# Altium schematic sheet Sensor.SchDoc
size A4; SheetNumber: 5; SheetTotal: 5
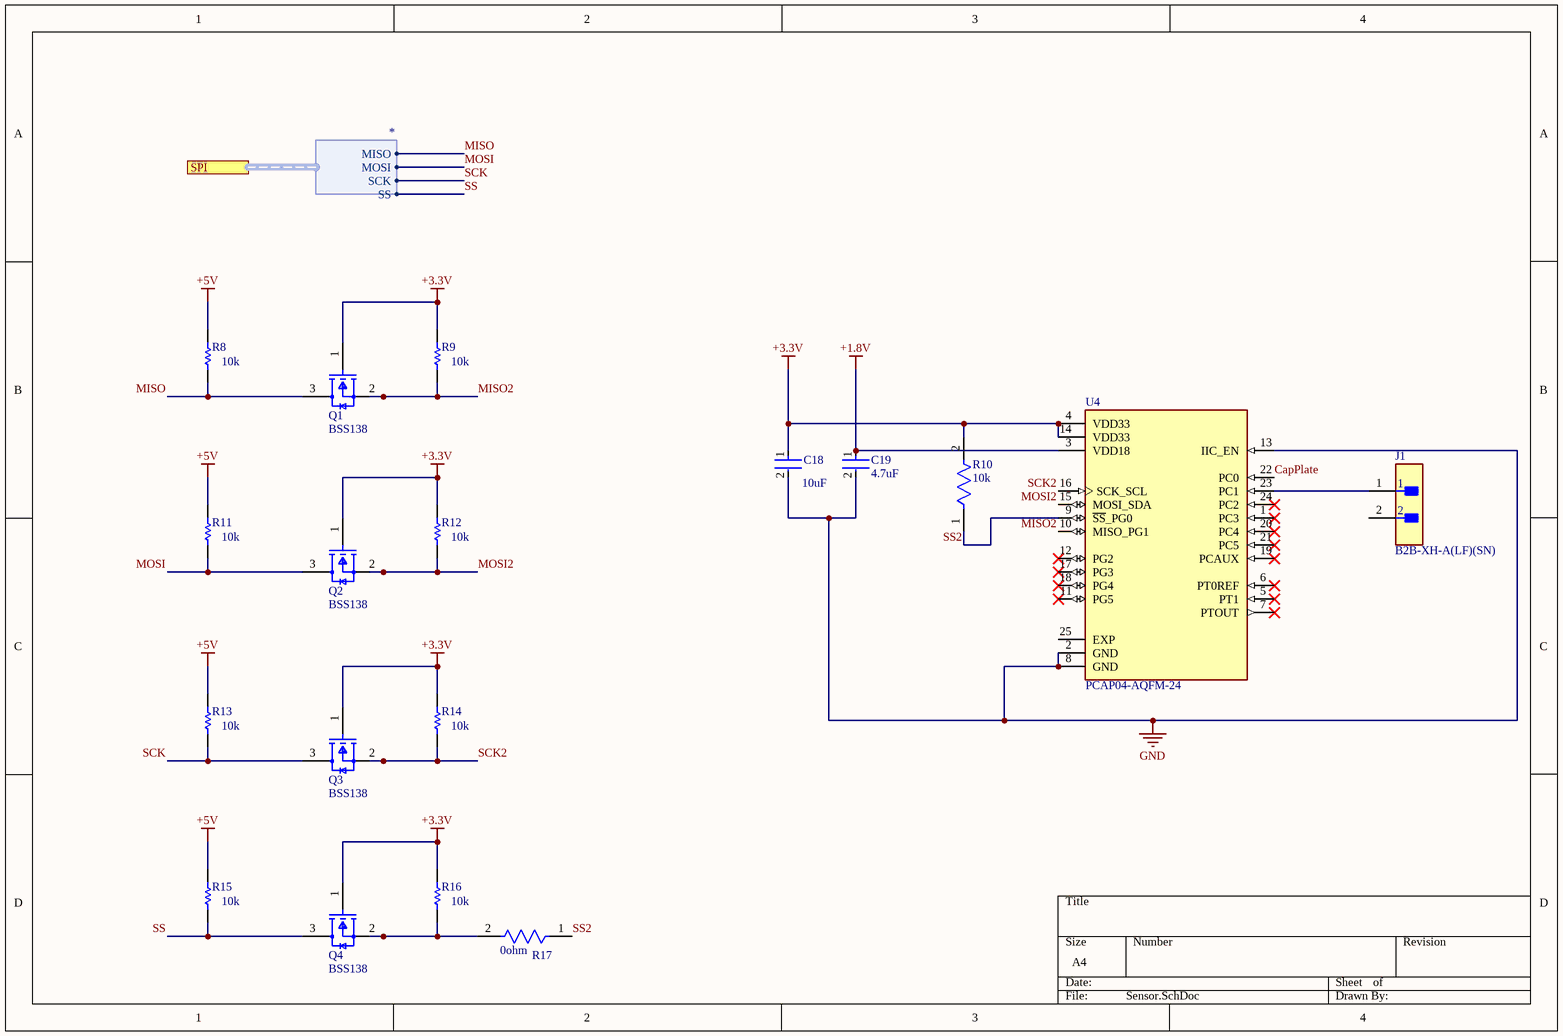
[diagram p0: Sensor.SchDoc]

## Parts
C18  Capacitance: 10uF  [FP-C0805C-DG-MFG]  (hidden comment: C0805C106K8PACTU)
C19  4.7uF  [FP-C0805C475K8PACTU-MFG]
J1  B2B-XH-A(LF)(SN)  [FP-B2B-XH-A_LF_SN-MFG]
Q1  BSS138  [FP-318-08-IPC_B]
Q2  BSS138  [FP-318-08-IPC_B]
Q3  BSS138  [FP-318-08-IPC_B]
Q4  BSS138  [FP-318-08-IPC_B]
R8  10k  [RESC3116X65X50NL20T20]
R9  10k  [RESC3116X65X50NL20T20]
R10  Resistance: 10k  [FP-CRCW0805-e3-IPC_C]  (hidden comment: CRCW080522R0FKEA)
R11  10k  [RESC3116X65X50NL20T20]
R12  10k  [RESC3116X65X50NL20T20]
R13  10k  [RESC3116X65X50NL20T20]
R14  10k  [RESC3116X65X50NL20T20]
R15  10k  [RESC3116X65X50NL20T20]
R16  10k  [RESC3116X65X50NL20T20]
R17  Resistance: 0ohm  [FP-CRCW0805-e3-IPC_C]  (hidden comment: CRCW080522R0FKEA)
U4  PCAP04-AQFM-24  [IC_PCAP04-AQFM-24]

## Ports
SPI (harness *, see Sheet2[2B], MCU[4C])

## Harnesses
*: MISO, MOSI, SCK, SS

## Nets
+1.8V: C19.1 U4.3(VDD18)
+3.3V: C18.1 Q1.1(G) Q2.1(G) Q3.1(G) Q4.1(G) R9.2 R10.2 R12.2 R14.2 R16.2 U4.4(VDD33) U4.14(VDD33)
+5V: R8.2 R11.2 R13.2 R15.2
GND: C18.2 C19.2 U4.2(GND) U4.8(GND) U4.13(IIC_EN)
CapPlate: U4.22(PC0)
MISO: Q1.3(D) R8.1 ; port SPI.MISO
MISO2: Q1.2(S) R9.1 U4.10(MISO_PG1)
MOSI: Q2.3(D) R11.1 ; port SPI.MOSI
MOSI2: Q2.2(S) R12.1 U4.15(MOSI_SDA)
SCK: Q3.3(D) R13.1 ; port SPI.SCK
SCK2: Q3.2(S) R14.1 U4.16(SCK_SCL)
SS: Q4.3(D) R15.1 ; port SPI.SS
SS2: R10.1 R17.1 U4.9(~{SS}_PG0)
NetJ1_1: J1.1 U4.23(PC1)
NetQ4_2: Q4.2(S) R16.1 R17.2

Not connected (* = marked no-connect by the designer): J1 2; U4 1(PC3)* 5(PT1)* 6(PT0REF)* 7(PTOUT)* 11(PG5)* 12(PG2)* 17(PG3)* 18(PG4)* 19(PCAUX)* 20(PC4)* 21(PC5)* 24(PC2)* 25(EXP)

## Library data of the parts
C18 = CMP-2007-03243-2: CAP CER 10UF 10V X5R 0805; Manufacturer: Kemet; 3DS Part Number: 220-00001; Tolerance: 10%; Temperature Coefficient: 15%; Material: Ceramic; Device Class L2: Capacitors; Device Class L1: Passive Components; ComponentLink2URL: https://content.kemet.com/datasheets/KEM_C1006_X5R_SMD.pdf; Height: 1.4mm; Lead Free: Yes; Manufacturer Part Number: C0805C106K8PACTU; Digikey Description: CAP CER 10UF 10V X5R 0805; Octopart: https://octopart.com/c0805c106k8pactu-kemet-98697; Value: 10uF; Temperature Range Low: -55°C; Temperature: -55°C to +85°C; Automotive: No; Mouser Description: CAP CER 10UF 10V X5R 0805; Ipc Land Pattern Name: CAPC200125X125; Temperature Range High: +85°C; Voltage: 10V; RoHS: TRUE; Device Class L3: Ceramic Capacitors; ComponentLink2Description: Datasheet; Voltage Rating: 10V; Package: C0805C-DG; Temperature Characteristic: X5R; Category: Cap
C19 = CMP-2007-01007-2: CAP CER 4.7UF 10V X5R 0805; Dielectric Material: Ceramic; Dissipation Factor: 5%; Tolerance: 10%; Lead Pitch: 0.75mm; Mount: Surface Mount; Voltage Rating (DC): 10V; Length: 2mm; Case Code (Imperial): 0805; Height: 1.25mm; Package Quantity: 1; Thickness: 0.055inch; Depth: 1.25mm; Case Code (Metric): 2012; Termination: SMD/SMT; Construction: Flat; Dielectric: X5R; Series: C; Capacitance: 4.7uF; Width: 1.2mm; Max Operating Temperature: 85°C; Packaging: Tape and Reel; Voltage Rating: 10V; REACH SVHC: No SVHC; Min Operating Temperature: -55°C; Number of Pins: 2; Case/Package: 0805; Radiation Hardening: No; Lead Free: Lead Free; Voltage: 10V; RoHS Compliant: Yes
J1 = CMP-2000-05888-3: CONN HEADER VERT 2POS 2.5MM; Current Rating: 3A; Voltage Rating: 250V; Number of Contacts: 2; Contact Resistance: 20mR; Wire/Cable Gauge: 22AWG; Insulation Resistance: 1GR; Connector Type: Male Pin; Packaging: Bulk; Contact Material: Brass; Lead Free: Lead Free; Orientation: Straight; Contact Plating: Tin; Max Current Rating: 3A; Termination: Solder; Fastening Type: Detent; Depth: 5.75mm; Housing Material: Polyamide; REACH SVHC: No SVHC; Series: XH; Voltage Rating (AC): 250V; Number of Positions: 2; Color: Natural; Contact Type: Male Pin; Max Voltage Rating (DC): 250V; Pitch: 2.5mm; Lead Pitch: 2.5mm; Mount: Through Hole; Max Operating Temperature: 85°C; Length: 7.4mm; Max Voltage Rating (AC): 250V; Min Operating Temperature: -25°C; Number of Rows: 1; Housing Color: White
Q1-Q4 = CMP-07173-000101-1: MOSFET N-CH 50V 220MA SOT-23; Turn-Off Delay Time: 20ns; Element Configuration: Single; Rds On Max: 3.5R; Gate to Source Voltage (Vgs): 20V; Threshold Voltage: 1.3V; Number of Elements: 1; Power Dissipation: 360mW; Rise Time: 9ns; Turn-On Delay Time: 2.5ns; Input Capacitance: 27pF; On-State Resistance: 6R; Lead Free: Lead Free; Length: 2.92mm; Width: 1.3mm; Drain to Source Breakdown Voltage: 50V; Min Operating Temperature: -55°C; REACH SVHC: No SVHC; Packaging: Tape and Reel; Radiation Hardening: No; Height: 0.93mm; Drain to Source Voltage (Vdss): 50V; Current Rating: 220mA; Voltage Rating (DC): 50V; Weight: 0.03g; Continuous Drain Current (ID): 220mA; Number of Pins: 3; Nominal Vgs: 1.3V; Max Power Dissipation: 360mW; Fall Time: 9ns; Drain to Source Resistance: 3.5R; Contact Plating: Tin; Case/Package: SOT-23; Package Quantity: 1; Dual Supply Voltage: 50V; Mount: Surface Mount; Termination: SMD/SMT; Max Operating Temperature: 150°C
R8 R9 R11-R16 = CMP-2003-04883-1: Part Number: CRCW120610K0FKEAHP; Manufacturer: Vishay Dale
R10 R17 = CMP-2001-03692-2: RES Thick Film, 22Ω, 1%, 0.125W, 100ppm/°C, 0805; Power Rating: 125mW; Voltage Rating: 150V; Case/Package: 0805; Radiation Hardening: No; Number of Terminations: 2; Termination: SMD/SMT; Package Quantity: 5000; Weight: 0.000194oz; Mount: Surface Mount; Lead Free: Lead Free; Height: 0.45mm; Composition: Thick Film; Min Operating Temperature: -55°C; Case Code (Metric): 2012; Temperature Coefficient: 100ppm/°C; Depth: 1.25mm; Packaging: Tape and Reel; Contact Plating: Tin; Width: 1.25mm; Case Code (Imperial): 0805; Length: 2mm; Max Operating Temperature: 155°C; Tolerance: 1%; Features: Automotive AEC-Q200; Military Standard: Not; Voltage Rating (DC): 150V; Max Power Dissipation: 125mW
U4 = CMP-007-000000-1: Capacitance-to-Digital Converter 17 b IÂ²C, SPI 24-QFN (4x4); MF: ScioSense; Value: *; Pin Count: 25; Package: QFN-24 ScioSense; Component Type: Standard; MP: PCAP04-AQFM-24; Design Item ID: PCAP04-AQFM-24; Source: PCAP04-AQFM-24.SchLib; Check_prices: https://www.snapeda.com/parts/PCAP04-AQFM-24/ScioSense/view-part/?ref=eda; SnapEDA_Link: https://www.snapeda.com/parts/PCAP04-AQFM-24/ScioSense/view-part/?ref=snap